# Altium schematic sheet CassetteMod.SchDoc
size A; SheetNumber: 1; SheetTotal: 1
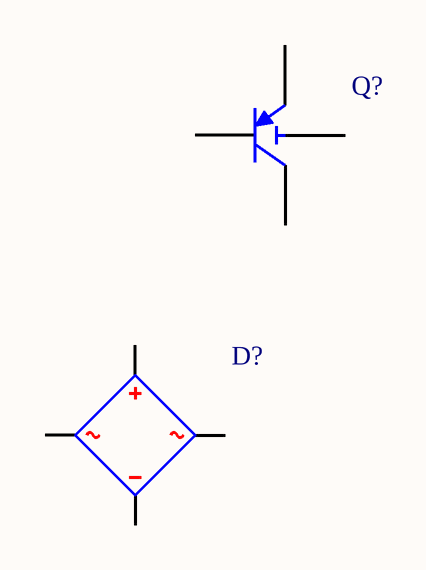
[diagram p0: CassetteMod.SchDoc]

## Parts
D?  Four Diodes Bridge Rectifier  (value not drawn)
Q?  Bipolar  PNP 4 Pins  Transistor  Modified Version of the Gummel-Poon Mod  (value not drawn)

## Nets

Not connected (* = marked no-connect by the designer): D? 1 2 + -; Q? 1(C) 2(B) 3(E) 4(S)

## Library data of the parts
D? = Bridge Rectifier: area: 1; temp: 27; dtemp: 0; EG: 1.11; FC: 0.5; IBV: 100p; IS: 10f; NTUN: 30; XTITUN: 3; MJSW: 0.33; BV_MAX: 1e99; SimulationGenericComponent: True; pj: 1; AF: 1; BV: 0; CJO: 0; IBVL: 0; IKF: 0; IKR: 0; JSW: 0; JTUN: 0; JTUNSW: 0; KEG: 1; CJP: 0; FCS: 0.5; PHP: 1; ISR: 0; KF: 0; N: 1; NBV: 1; NBVL: 1; NR: 1; NS: 1; RS: 0; TBV1: 0; TBV2: 0; TIKF: 0; TRS1: 0; TRS2: 0; TT: 0; VJ: 1; XTI: 3; TNOM: 27; TM1: 0; TM2: 0; TTT1: 0; TTT2: 0; TLEV: 0; TLEVC: 0; CTA: 0; CTP: 0; TCV: 0; TVJ: 0; TPHP: 0; FV_MAX: 1e99; M: 0.5
Q? = BJT PNP 4 MGP: Bipolar  PNP 4 Pins  Transistor  Modified Version of the Gummel-Poon Model; BF: 100; AF: 0; BR: 1; EG: 1.11; FC: 0.5; IS: 1e-16; MJC: 0.33; NC: 2; NE: 1.5; TNOM: 27; VBC_MAX: 1e99; VJC: 0.75; XTI: 3; SimulationGenericComponent: True; CJC: 0; CJE: 0; CJS: 0; CTC: 0; CTE: 0; CTS: 0; IKF: 0; IKR: 0; IRB: 0; ISC: 0; ISE: 0; ISS: 0; ITF: 0; KF: 0; MJE: 0.33; MJS: 0; NF: 1; NKF: 0.5; NR: 1; NS: 1; PTF: 0; RB: 0; RBM: 0; RC: 0; RE: 0; SUBS: 1; TBF1: 0; TBF2: 0; TBR1: 0; TBR2: 0; TF: 0; TIKF1: 0; TIKF2: 0; TIKR1: 0; TIKR2: 0; TIRB1: 0; TIRB2: 0; TIS1: 0; TIS2: 0; TISC1: 0; TISC2: 0; TISE1: 0; TISE2: 0; TITF1: 0; TITF2: 0; TLEV: 0; TLEVC: 0; TMJC1: 0; TMJC2: 0; TMJE1: 0; TMJE2: 0; TMJS1: 0; TMJS2: 0; TNC1: 0; TNC2: 0; TNE1: 0; TNE2: 0; TNF1: 0; TNF2: 0; TNR1: 0; TNR2: 0; TNS1: 0; TNS2: 0; TR: 0; TRB1: 0; TRB2: 0; TRC1: 0; TRC2: 0; TRE1: 0; TRE2: 0; TRM1: 0; TRM2: 0; TTF1: 0; TTF2: 0; TTR1: 0; TTR2: 0; TVAF1: 0; TVAF2: 0; TVAR1: 0; TVAR2: 0; TVJC: 0; TVJE: 0; TVJS: 0; VAF: 0; VAR: 0; VBE_MAX: 1e99; VCE_MAX: 1e99; VJE: 0.75; VJS: 0.75; VTF: 0; XCJC: 1; XTB: 0; XTF: 0